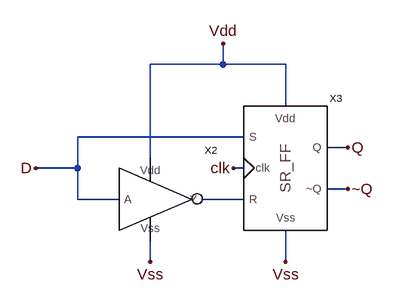
[diagram p0: schematic D_FF_IC.asc]
D_FF_IC.asc, the LTspice schematic file:
Version 4
SHEET 1 1084 680
WIRE 96 -32 96 -64
WIRE 96 -32 -16 -32
WIRE 192 -32 96 -32
WIRE 192 32 192 -32
WIRE 128 80 -128 80
WIRE 288 96 256 96
WIRE -16 112 -16 -32
WIRE -128 128 -128 80
WIRE -128 128 -192 128
WIRE 128 128 112 128
WIRE 288 160 256 160
WIRE -128 176 -128 128
WIRE -64 176 -128 176
WIRE 128 176 64 176
WIRE -16 272 -16 240
WIRE 192 272 192 224
FLAG 288 96 Q
FLAG 288 160 ~Q
FLAG -192 128 D
FLAG 112 128 clk
FLAG 96 -64 Vdd
FLAG 192 272 Vss
FLAG -16 272 Vss
SYMBOL not -32 176 R0
SYMATTR InstName X2
SYMBOL SR_FF_IC 224 144 R0
SYMATTR InstName X3

The netlist it stands for:
* D_FF_IC.asc
XX2 N001 D Vdd Vss not  ; pins Y A Vdd Vss
XX3 clk D N001 Q ~Q Vdd Vss SR_FF_IC  ; pins clk S R Q ~Q Vdd Vss
.backanno
.end